# EAGLE design PowerBoard (EAGLE 9.0.0)
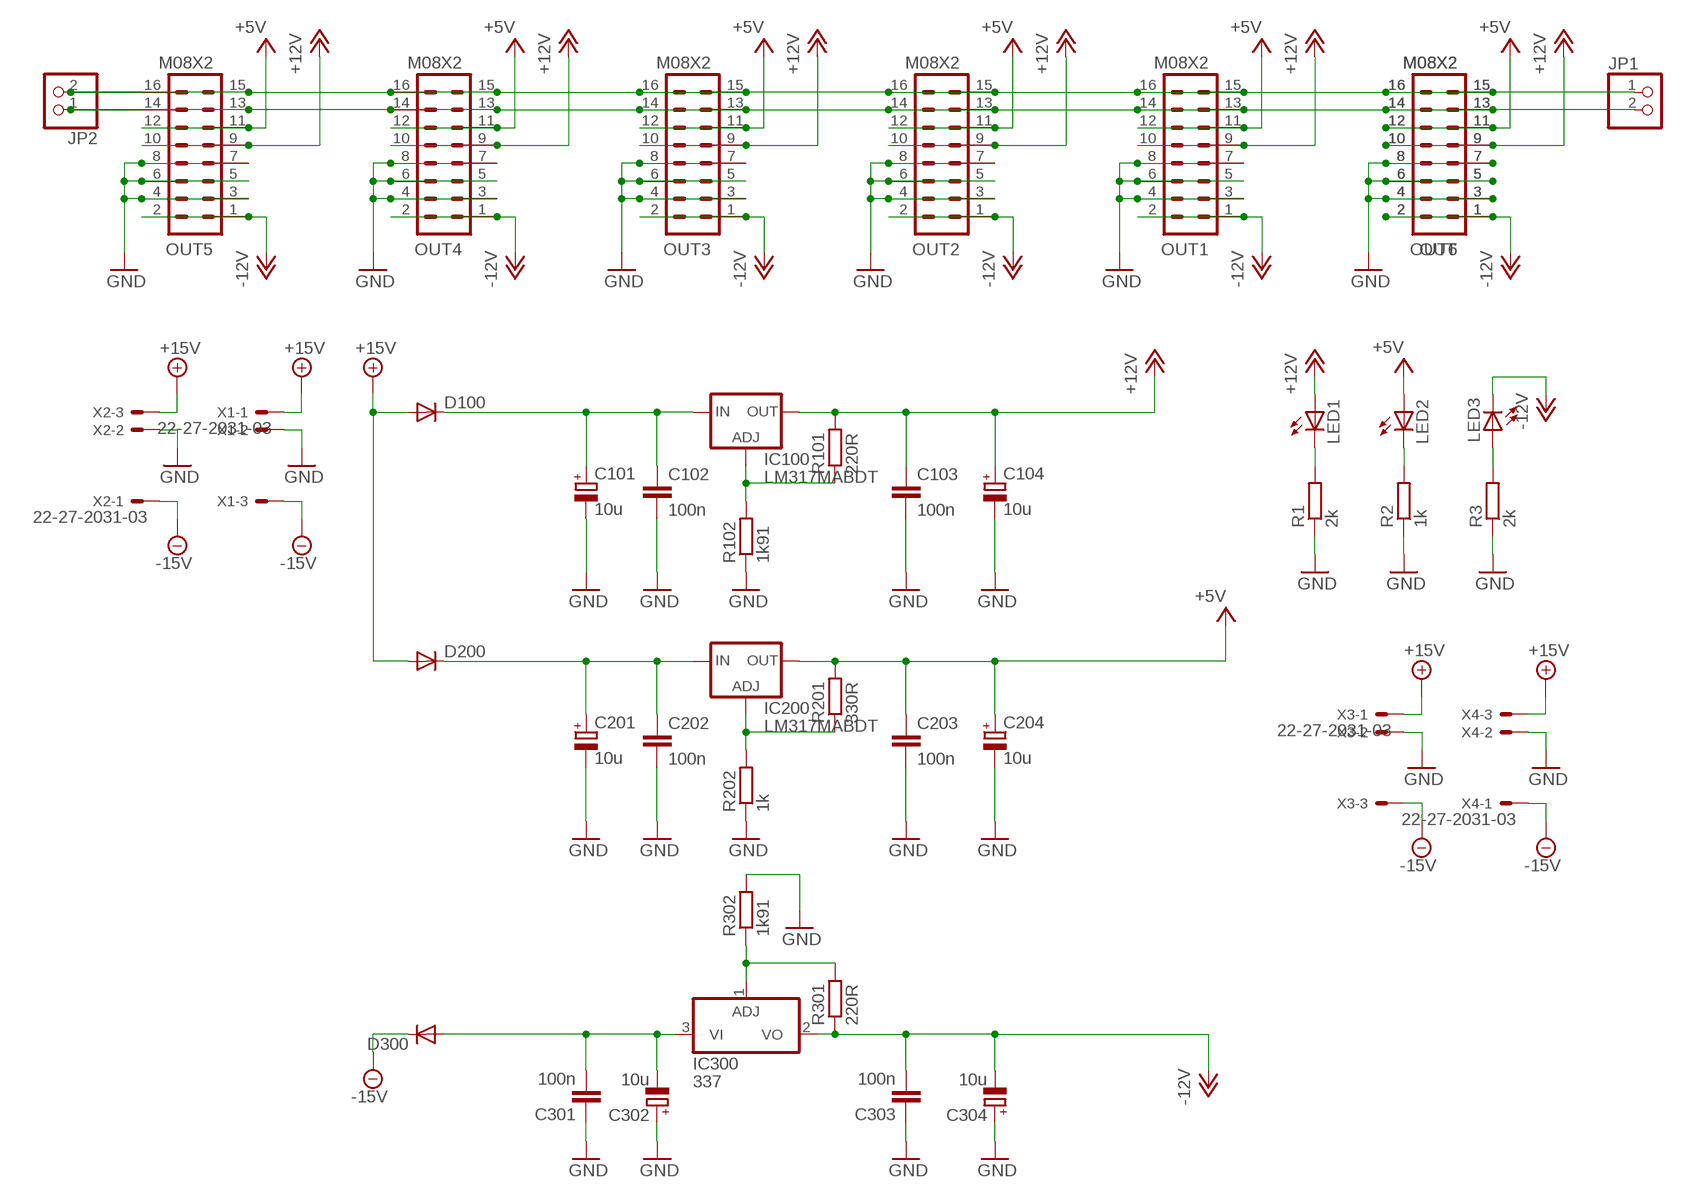
[diagram p0: schematic, sheet 1]

## Parts
C101  10u  CPOL-EU153CLV-0810  [153CLV-0810]
C102  100n  C-EUC0603  [C0603]
C103  100n  C-EUC0603  [C0603]
C104  10u  CPOL-EU153CLV-0810  [153CLV-0810]
C201  10u  CPOL-EU153CLV-0810  [153CLV-0810]
C202  100n  C-EUC0603  [C0603]
C203  100n  C-EUC0603  [C0603]
C204  10u  CPOL-EU153CLV-0810  [153CLV-0810]
C301  100n  C-EUC0603  [C0603]
C302  10u  CPOL-EU153CLV-0810  [153CLV-0810]
C303  100n  C-EUC0603  [C0603]
C304  10u  CPOL-EU153CLV-0810  [153CLV-0810]
D100  DIODESMA  [SMA-DIODE]
D200  DIODESMA  [SMA-DIODE]
D300  DIODESMA  [SMA-DIODE]
IC100  LM317MABDT  [DPACK]
IC200  LM317MABDT  [DPACK]
IC300  337  [TO252]
JP1  PINHD-1X2  [1X02]
JP2  PINHD-1X2  [1X02]
LED1  LEDCHIPLED_1206  [CHIPLED_1206]
LED2  LEDCHIPLED_1206  [CHIPLED_1206]
LED3  LEDCHIPLED_1206  [CHIPLED_1206]
OUT  M08X2  [2X8]
OUT1  M08X2  [2X8]
OUT2  M08X2  [2X8]
OUT3  M08X2  [2X8]
OUT4  M08X2  [2X8]
OUT5  M08X2  [2X8]
OUT6  M08X2  [2X8]
R1  2k  R-EU_0603  [0603]
R2  1k  R-EU_0603  [0603]
R3  2k  R-EU_0603  [0603]
R101  220R  R-EU_0603  [0603]
R102  1k91  R-EU_0603  [0603]
R201  330R  R-EU_0603  [0603]
R202  1k  R-EU_0603  [0603]
R301  220R  R-EU_0603  [0603]
R302  1k91  R-EU_0603  [0603]
X1  22-27-2031-03  [6410-03]
X2  22-27-2031-03  [6410-03]
X3  22-27-2031-03  [6410-03]
X4  22-27-2031-03  [6410-03]

## Nets
+5V: C203.1 C204.+ IC200.4(OUT) LED2.A OUT1.11 OUT1.12 OUT2.11 OUT2.12 OUT3.11 OUT3.12 OUT4.11 OUT4.12 OUT5.11 OUT5.12 OUT6.11 OUT6.12 OUT.11 OUT.12 R201.2
+12V: C103.1 C104.+ IC100.4(OUT) LED1.A OUT1.9 OUT1.10 OUT2.9 OUT2.10 OUT3.9 OUT3.10 OUT4.9 OUT4.10 OUT5.9 OUT5.10 OUT6.9 OUT6.10 OUT.9 OUT.10 R101.2
+15V: D100.A D200.A X1.1 X2.3 X3.1 X4.3
-12V: C303.2 C304.- IC300.2(VO) LED3.C OUT1.1 OUT1.2 OUT2.1 OUT2.2 OUT3.1 OUT3.2 OUT4.1 OUT4.2 OUT5.1 OUT5.2 OUT6.1 OUT6.2 OUT.1 OUT.2 R301.1
-15V: D300.C X1.3 X2.1 X3.3 X4.1
GND: C101.- C102.2 C103.2 C104.- C201.- C202.2 C203.2 C204.- C301.1 C302.+ C303.1 C304.+ OUT1.3 OUT1.4 OUT1.5 OUT1.6 OUT1.7 OUT1.8 OUT2.3 OUT2.4 OUT2.5 OUT2.6 OUT2.7 OUT2.8 OUT3.3 OUT3.4 OUT3.5 OUT3.6 OUT3.7 OUT3.8 OUT4.3 OUT4.4 OUT4.5 OUT4.6 OUT4.7 OUT4.8 OUT5.3 OUT5.4 OUT5.5 OUT5.6 OUT5.7 OUT5.8 OUT6.3 OUT6.4 OUT6.5 OUT6.6 OUT6.7 OUT6.8 OUT.3 OUT.4 OUT.5 OUT.6 OUT.7 OUT.8 R1.1 R2.1 R3.1 R102.1 R202.1 R302.2 X1.2 X2.2 X3.2 X4.2
N$1: LED1.C R1.2
N$2: LED2.C R2.2
N$3: IC100.1(ADJ) R101.1 R102.2
N$4: IC200.1(ADJ) R201.1 R202.2
N$5: IC300.1(ADJ) R301.2 R302.1
N$6: C301.2 C302.- D300.A IC300.3(VI)
N$7: C201.+ C202.1 D200.C IC200.3(IN)
N$8: C101.+ C102.1 D100.C IC100.3(IN)
N$9: LED3.A R3.2
N$10: JP1.2 JP2.1 OUT1.13 OUT1.14 OUT2.13 OUT2.14 OUT3.13 OUT3.14 OUT4.13 OUT4.14 OUT5.13 OUT5.14 OUT6.13 OUT6.14 OUT.13 OUT.14
N$12: JP1.1 JP2.2 OUT1.15 OUT1.16 OUT2.15 OUT2.16 OUT3.15 OUT3.16 OUT4.15 OUT4.16 OUT5.15 OUT5.16 OUT6.15 OUT6.16 OUT.15 OUT.16

## Library data of the parts
C101 C104 C201 C204 C302 C304 = rcl:CPOL-EU: POLARIZED CAPACITOR, European symbol
C102 C103 C202 C203 C301 C303 = rcl:C-EU: CAPACITOR, European symbol
D100 D200 D300 = SparkFun:DIODE: Diode These are standard reverse protection diodes and small signal diodes. SMA package can handle up to about 1A. SOD-323 can handle about 200mA. What the SOD-323 package when ordering, there are some mfgs out there that are 5-pin packages.
IC100 IC200 = v-reg:LM317?*: 500 mA Adjustable Output Positive Voltage Regulator Source: http://www.onsemi.co.jp .. LM317M-D.PDF
IC300 = linear:*337: Negative VOLTAGE REGULATOR
JP1 JP2 = pinhead:PINHD-1X2: PIN HEADER
LED1-LED3 = led:LED: LED OSRAM: - CHIPLED LG R971, LG N971, LY N971, LG Q971, LY Q971, LO R971, LY R971 LH N974, LH R974 LS Q976, LO Q976, LY Q976 LO Q996 - Hyper CHIPLED LW Q18S LB Q993, LB Q99A, LB R99A - SideLED LS A670, LO A670, LY A670, LG A670, LP A670 LB A673, LV A673, LT A673, LW A673 LH A674 LY A675 LS A676, LA A676, LO A676, LY A676, LW A676 LS A679, LY A679, LG A679 - Hyper Micro SIDELED® LS Y876, LA Y876, LO Y876, LY Y876 LT Y87S - SmartLED LW L88C, LW L88S LB L89C, LB L89S, LG L890 LS L89K, LO L89K, LY L89K LS L896, LA L896, LO L896, LY L896 - TOPLED LS T670, LO T670, LY T670, LG T670, LP T670 LSG T670, LSP T670, LSY T670, LOP T670, LYG T670 LG T671, LOG T671, LSG T671 LB T673, LV T673, LT T673, LW T673 LH T674 LS T676, LA T676, LO T676, LY T676, LB T676, LH T676, LSB T676, LW T676 LB T67C, LV T67C, LT T67C, LS T67K, LO T67K, LY T67K, LW E67C LS E67B, LA E67B, LO E67B, LY E67B, LB E67C, LV E67C, LT E67C LW T67C LS T679, LY T679, LG T679 LS T770, LO T770, LY T770, LG T770, LP T770 LB T773, LV T773, LT T773, LW T773 LH T774 LS E675, LA E675, LY E675, LS T675 LS T776, LA T776, LO T776, LY T776, LB T776 LHGB T686 LT T68C, LB T68C - Hyper Mini TOPLED® LB M676 - Mini TOPLED Santana® LG M470 LS M47K, LO M47K, LY M47K Source: http://www.osram.convergy.de LUXEON: - LUMILED® LXK2-PW12-R00, LXK2-PW12-S00, LXK2-PW14-U00, LXK2-PW14-V00 LXK2-PM12-R00, LXK2-PM12-S00, LXK2-PM14-U00 LXK2-PE12-Q00, LXK2-PE12-R00, LXK2-PE12-S00, LXK2-PE14-T00, LXK2-PE14-U00 LXK2-PB12-K00, LXK2-PB12-L00, LXK2-PB12-M00, LXK2-PB14-N00, LXK2-PB14-P00, LXK2-PB14-Q00 LXK2-PR12-L00, LXK2-PR12-M00, LXK2-PR14-Q00, LXK2-PR14-R00 LXK2-PD12-Q00, LXK2-PD12-R00, LXK2-PD12-S00 LXK2-PH12-R00, LXK2-PH12-S00 LXK2-PL12-P00, LXK2-PL12-Q00, LXK2-PL12-R00 Source: www.luxeon.com KINGBRIGHT: KA-3528ASYC Source: www.kingbright.com
OUT OUT1-OUT6 = SparkFun:M08X2
R1-R3 R101 R102 R201 R202 R301 R302 = Rebel:R-EU_: RESISTOR, European symbol
X1-X4 = con-molex:22-?-03: CONNECTOR wire to board 2.54 mm (.1 inch) pitch header; MF: MOLEX; OC_FARNELL: unknown; OC_NEWARK: unknown

## Board
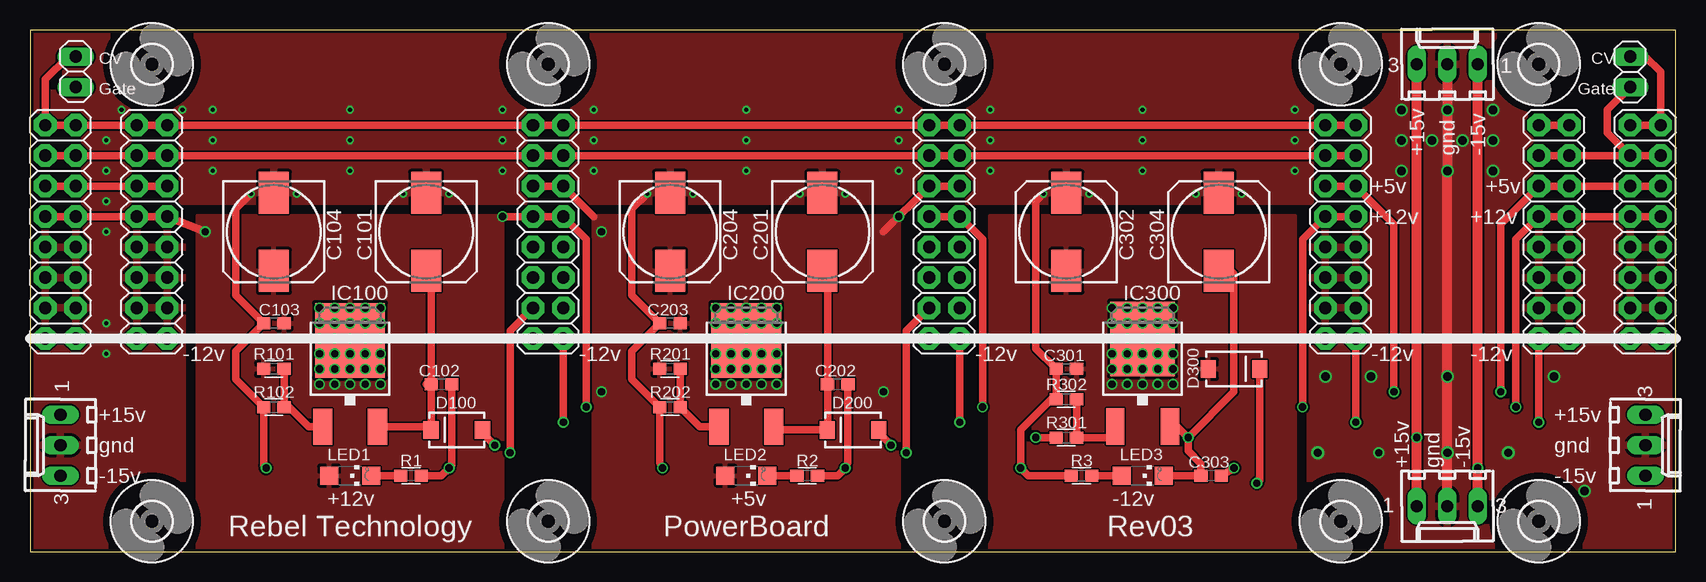
[diagram p1: board, top side]
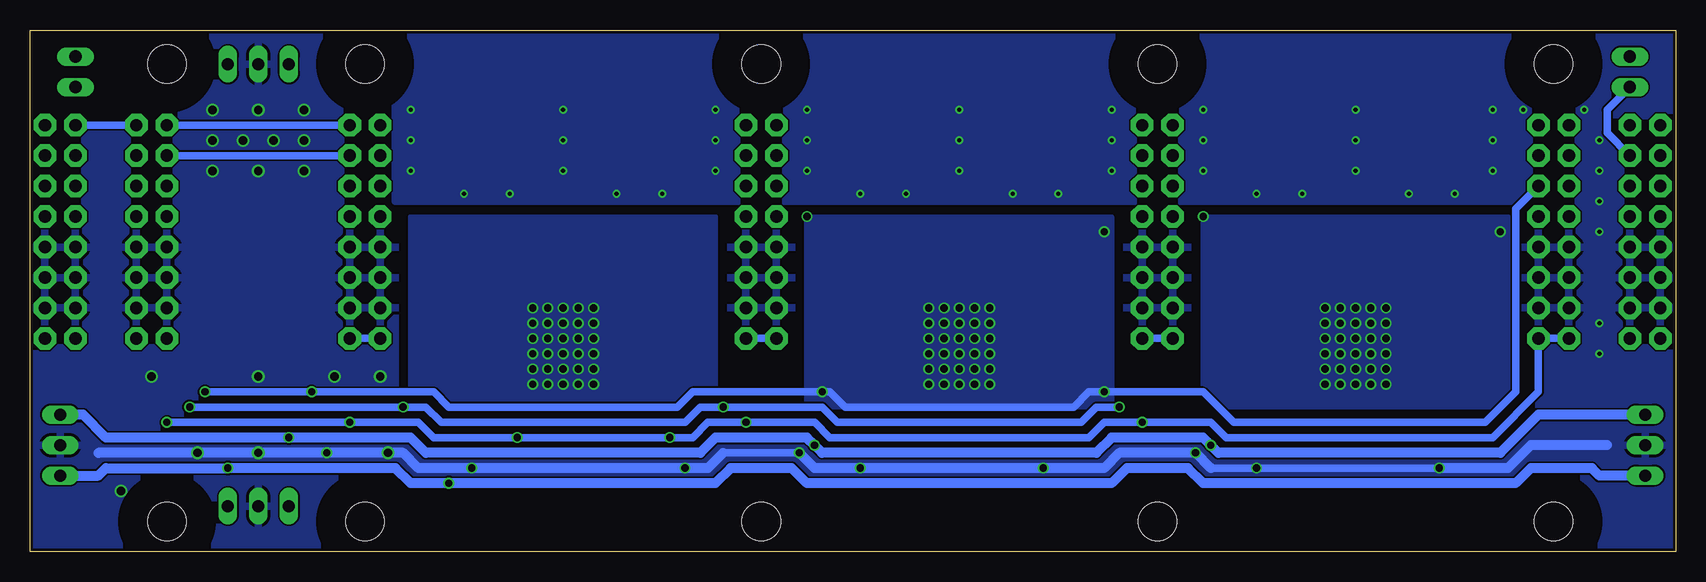
[diagram p2: board, bottom side, seen from below]

Size 137.13 x 43.48 mm. Coordinates in mm from the lower left corner, seen from the top.
Outline: 0,0 137.13,0 137.13,43.48 0,43.48 0,0
Copper layers (1*16): Top 0.035mm / dielectric 1.5mm / Bottom 0.035mm
Design rules "Fusion_eagle_rule_v1.1": minimum track width 6mil, minimum drill 12mil, track to track 6mil, track to pad 6mil, pad to pad 6mil, via to via 6mil, smd to smd 0mil, copper to edge 10mil, drill to drill 10mil, minimum pad ring 10mil, minimum via ring 6mil, stop-mask expansion 2mil, vias tented up to drill 100mil, thermal gap 10mil

### Footprints (pad centres in the part's own frame; a part is rotated, then mirrored left to right if it is on the bottom)
153CLV-0810 = smd 3.5 x 2.5: + 3.25,0; - -3.25,0
C0603 = smd 1.1 x 1: 1 -0.85,0; 2 0.85,0
SMA-DIODE = smd 1.27 x 1.47: A -2.15,0; C 2.15,0
DPACK = smd 1.6 x 3: 1 -2.28,-4.8; 3 2.28,-4.8 | smd 5.8 x 6.2: 4 0,2.38
TO252 = smd 1.524 x 3.048: 1 -2.28,-4.8; 2 2.28,-4.8 | smd 5.4 x 6.2: 3 0,2.5
1X02 = drill 1.016 long: 1 -1.27,0; 2 1.27,0
CHIPLED_1206 = smd 1.5 x 1.5: A 0,-1.75; C 0,1.75
2X8 = drill 1.016 pad 1.88 octagon: 1 0,0; 2 0,2.54; 3 2.54,0; 4 2.54,2.54; 5 5.08,0; 6 5.08,2.54; 7 7.62,0; 8 7.62,2.54; 9 10.16,0; 10 10.16,2.54; 11 12.7,0; 12 12.7,2.54; 13 15.24,0; 14 15.24,2.54; 15 17.78,0; 16 17.78,2.54
0603 = smd 1.1 x 1: 1 -0.85,0; 2 0.85,0
3,2 = hole 3.2: 0,0
6410-03 = drill 1.016 long: 1 2.54,0; 2 0,0; 3 -2.54,0

### Placement (x,y rotation side)
C101  33.02,26.67 270 top
C102  34.29,13.97 0 top
C103  20.32,19.05 180 top
C104  20.32,26.67 270 top
C201  66.04,26.67 270 top
C202  67.31,13.97 0 top
C203  53.34,19.05 180 top
C204  53.34,26.67 270 top
C301  86.36,15.24 0 top
C302  86.36,26.67 90 top
C303  98.42,6.35 180 top
C304  99.06,26.67 90 top
D100  35.56,10.16 180 top
D200  68.58,10.16 180 top
D300  100.33,15.24 0 top
IC100  26.67,15.24 0 top
IC200  59.69,15.24 0 top
IC300  92.71,15.24 0 top
JP1  3.81,40.01 270 top
JP2  133.35,40.01 90 top
LED1  26.67,6.35 270 top
LED2  59.69,6.35 270 top
LED3  92.71,6.35 270 top
OUT  11.43,17.78 90 top
OUT1  44.45,17.78 90 top
OUT2  77.47,17.78 90 top
OUT3  110.49,17.78 90 top
OUT4  135.89,17.78 90 top
OUT5  3.81,17.78 90 top
OUT6  128.27,17.78 90 top
R1  31.75,6.35 180 top
R2  64.77,6.35 180 top
R3  87.63,6.35 0 top
R101  20.32,15.24 180 top
R102  20.32,12.06 0 top
R201  53.34,15.24 180 top
R202  53.34,12.06 0 top
R301  86.36,9.53 0 top
R302  86.36,12.7 180 top
U$1  [3,2]  43.18,2.54 0 top
U$2  [3,2]  109.22,2.54 0 top
U$3  [3,2]  43.18,40.64 0 top
U$4  [3,2]  109.22,40.64 0 top
U$5  [3,2]  10.16,40.64 0 top
U$6  [3,2]  10.16,2.54 0 top
U$7  [3,2]  76.2,40.64 0 top
U$8  [3,2]  76.2,2.54 0 top
U$12  [3,2]  125.73,40.64 0 top
U$13  [3,2]  125.73,2.54 0 top
X1  2.54,8.89 90 top
X2  134.62,8.89 270 top
X3  118.11,3.81 180 top
X4  118.11,40.64 0 top

### Tracks (layer width: path | path; a pad name or v marks a point on that pad's centre or on a via)
+5V  (via drill 0.6)
  Top 0.61: 46.99,27.94 OUT1.11 OUT1.12 | 71.12,26.67 OUT2.12 OUT2.11 | OUT5.12 OUT5.11 OUT.12 OUT.11 | OUT3.12 OUT3.11 113.67,27.3 v113.67,13.34 | v122.56,13.34 122.56,27.3 OUT6.12 OUT6.11 OUT4.12 OUT4.11
  Bottom 0.61: OUT.11 13.34,28.57 13.34,13.34 15.88,10.79 36.83,10.79 39.37,13.34 v47.62,13.34 48.89,13.34 50.16,12.06 69.22,12.06 70.48,13.34 81.92,13.34 83.19,12.06 102.23,12.06 103.51,13.34 v113.67,13.34 v122.56,13.34
  other vias: 57.15,20.32 58.42,20.32 57.15,19.05 58.42,19.05 57.15,17.78 58.42,17.78 59.69,20.32 59.69,19.05 59.69,17.78 60.96,20.32 62.23,20.32 60.96,19.05 62.23,19.05 60.96,17.78 62.23,17.78 62.23,16.51 60.96,16.51 60.96,15.24 62.23,15.24 59.69,16.51 59.69,15.24 58.42,16.51 57.15,16.51 57.15,15.24 57.15,13.97 58.42,15.24 58.42,13.97 59.69,13.97 60.96,13.97 62.23,13.97 47.62,26.67 72.39,27.94 71.12,13.34
  pour Bottom: 46.99,27.94 46.99,12.06 72.39,12.06 72.39,27.94
  pour Top: 46.99,27.94 46.99,0 72.39,0 72.39,27.94
+12V  (via drill 0.6)
  Top 0.61: v46.35,12.06 46.35,26.04 OUT1.9 OUT1.10 v39.37,27.94 | v79.38,12.06 79.38,26.04 OUT2.9 OUT2.10 | v106.05,12.06 106.05,26.04 OUT3.10 OUT3.9 | v14.61,26.67 OUT.9 OUT.10 OUT5.9 OUT5.10 | v123.83,12.06 123.83,26.04 OUT6.10 OUT6.9 OUT4.10 OUT4.9
  Bottom 0.61: v46.35,12.06 48.26,12.06 49.53,10.79 69.85,10.79 71.12,12.06 v79.38,12.06 81.28,12.06 82.55,10.79 102.87,10.79 104.14,12.06 v106.05,12.06 v123.83,12.06
  other vias: 24.13,20.32 25.4,20.32 24.13,19.05 26.67,20.32 27.94,20.32 29.21,20.32 29.21,19.05 27.94,19.05 26.67,19.05 25.4,19.05 24.13,17.78 24.13,16.51 24.13,15.24 24.13,13.97 25.4,17.78 26.67,17.78 27.94,17.78 29.21,17.78 29.21,16.51 27.94,16.51 26.67,16.51 25.4,16.51 25.4,15.24 25.4,13.97 26.67,13.97 26.67,15.24 27.94,15.24 27.94,13.97 29.21,15.24 29.21,13.97
  pour Bottom: 13.97,27.94 13.97,12.06 39.37,12.06 39.37,27.94
  pour Top: 13.97,27.94 13.97,0 39.37,0 39.37,27.94
+15V  (via drill 0.6)
  Top 0.61: D100.A 37.46,10.16 v38.73,8.89 | D200.A 70.48,10.16 v71.76,8.89
  Top 0.813: X3.1 v115.57,9.53 X4.3
  Bottom 0.813: X1.1 11.43,11.43 14.61,8.26 38.1,8.26 v38.73,8.89 39.37,9.53 46.99,9.53 48.26,8.26 71.12,8.26 v71.76,8.89 72.39,9.53 80.01,9.53 81.28,8.26 104.14,8.26 105.41,9.53 v115.57,9.53 130.81,9.53 132.72,11.43 X2.3
-12V  (via drill 0.6)
  Top 0.61: OUT1.1 v44.45,10.79 | OUT2.1 v77.47,10.79 | OUT3.1 v110.49,10.79 | OUT.2 OUT5.1 OUT5.2 | R301.1 v83.82,9.53 | IC300.2 95.61,10.44 v96.52,9.53 | OUT4.1 OUT4.2 OUT6.1 OUT6.2 v125.73,10.79 | C304.- 98.93,24.56 100.33,23.16 100.33,13.34 v96.52,9.53 | v96.52,9.53 96.52,8.41 97.58,7.36 C303.2 LED3.C
  Bottom 0.61: v125.73,10.79 v110.49,10.79 104.78,10.79 103.51,9.53 v96.52,9.53 v83.82,9.53 81.92,9.53 80.65,10.79 v77.47,10.79 71.76,10.79 70.48,9.53 48.89,9.53 47.62,10.79 v44.45,10.79 38.73,10.79 37.46,9.53 15.24,9.53 11.43,13.34 OUT.1 OUT.2 | OUT2.1 OUT2.2 | OUT1.1 OUT1.2 | OUT3.1 OUT3.2
-15V  (via drill 0.6)
  Top 0.61: D300.C 102.48,5.96 v102.23,5.71
  Top 0.813: X3.3 v120.65,6.99 X4.1
  Bottom 0.813: X1.3 6.35,6.35 6.99,6.99 12.07,6.99 13.34,5.71 39.37,5.71 40.64,6.99 45.72,6.99 46.99,5.71 72.39,5.71 73.66,6.99 78.74,6.99 80.01,5.71 v102.23,5.71 105.41,5.71 106.68,6.99 v120.65,6.99 130.81,6.99 131.44,6.35 X2.1
GND  (via drill 0.35, 0.6, 0.7)
  Top 0.61: OUT2.4 73.03,18.41 v73.03,8.26 | 20.32,29.21 C104.- | v19.68,6.99 19.47,7.2 R102.1 17.14,14.39 17.14,16.73 C103.2 17.14,21.38 17.14,28.57 v18.41,29.84 | OUT1.4 40,18.41 v40,8.26 | v52.7,6.99 52.49,7.41 R202.1 50.16,14.39 50.16,16.73 C203.2 50.16,21.38 50.16,28.57 v51.43,29.84 | C202.2 68.16,7.41 v67.95,6.99 67.31,6.35 R2.1 | C204.- 52.78,29.92 | C102.2 35.14,7.2 v34.92,6.99 34.29,6.35 R1.1 | C304.+ 99.06,29.84 | R3.1 83.19,6.35 v82.55,6.99 82.55,10.16 85.09,12.7 R302.2 C301.1 83.82,16.93 83.82,29.21 v84.45,29.84 | C303.1 v100.33,6.99
  Top 0.813: X3.2 v118.11,31.75 X4.2
  Bottom 0.61: v19.68,6.99 v34.92,6.99 38.73,6.99 | v73.03,8.26 79.38,8.26
  Bottom 0.813: 5.71,8.89 12.07,8.89 13.97,6.99 v19.68,6.99 | 38.73,6.99 v40,8.26 46.35,8.26 47.62,6.99 v52.7,6.99 v67.95,6.99 71.76,6.99 v73.03,8.26 | 79.38,8.26 80.65,6.99 v82.55,6.99 v100.33,6.99 104.78,6.99 106.05,8.26 v112.4,8.26 v118.11,8.26 131.44,8.26
  other vias: 118.11,14.61 15.24,36.83 26.67,36.83 39.37,36.83 46.99,36.83 59.69,36.83 72.39,36.83 80.01,36.83 92.71,36.83 105.41,36.83 22.23,29.84 31.11,29.84 34.92,29.84 64.14,29.84 67.95,29.84 55.24,29.84 88.27,29.84 97.16,29.84 100.97,29.84 6.35,16.51 6.35,19.05 6.35,26.67 6.35,29.21 6.35,31.75 6.35,34.29 7.62,36.83 12.7,36.83 15.24,34.29 26.67,34.29 39.37,34.29 46.99,34.29 59.69,34.29 72.39,34.29 80.01,34.29 92.71,34.29 105.41,34.29 118.11,36.83 116.84,34.29 119.38,34.29 121.92,34.29 114.3,34.29 114.3,36.83 121.92,36.83 121.92,31.75 114.3,31.75 111.76,14.61 107.95,14.61 127,14.61 129.54,5.08 15.24,31.75 26.67,31.75 39.37,31.75 46.99,31.75 59.69,31.75 72.39,31.75 92.71,31.75 105.41,31.75 80.01,31.75 123.19,8.26 107.31,8.26
  pour Bottom: -1.27,10.79 -1.27,0 138.43,0 138.43,10.79
  pour Bottom: -1.27,44.45 -1.27,0 12.7,0 12.7,29.21 106.68,29.21 106.68,44.45
  pour Bottom: 106.68,44.45 106.68,0 138.43,0 138.43,44.45
  pour Bottom: 106.68,26.67 111.76,26.67 111.76,19.05 106.68,19.05
  pour Bottom: 73.66,26.67 78.74,26.67 78.74,19.05 73.66,19.05
  pour Bottom: 40.64,26.67 45.72,26.67 45.72,19.05 40.64,19.05
  pour Top: 12.7,44.45 106.68,44.45 106.68,29.21 12.7,29.21
  pour Top: 0,44.45 12.7,44.45 12.7,0 0,0
  pour Top: 106.68,44.45 106.68,0 138.43,0 138.43,44.45
N$1
  Top 0.61: R1.2 LED1.C
N$2
  Top 0.61: R2.2 LED2.C
N$3
  Top 0.61: IC100.1 23.21,10.44 21.17,12.48 R102.2 R101.1
N$4
  Top 0.61: R202.2 54.19,13.12 | 57.15,10.16 57.41,10.42 IC200.1 55.81,10.44 R202.2 | R201.1 R202.2
N$5
  Top 0.61: IC300.1 90.15,9.53 R301.2 R302.1
N$6  (via drill 0.6)
  other vias: 90.17,20.32 91.44,20.32 92.71,20.32 93.98,20.32 95.25,20.32 95.25,19.05 93.98,19.05 92.71,19.05 91.44,19.05 90.17,19.05 90.17,17.78 90.17,16.51 90.17,15.24 90.17,13.97 91.44,17.78 91.44,16.51 91.44,15.24 91.44,13.97 92.71,17.78 92.71,16.51 92.71,15.24 93.98,17.78 95.25,17.78 93.98,16.51 95.25,16.51 95.25,15.24 93.98,15.24 92.71,13.97 93.98,13.97 95.25,13.97
  pour Bottom: 80.01,27.94 80.01,12.06 105.41,12.06 105.41,27.94
  pour Top: 80.01,27.94 80.01,0 105.41,0 105.41,27.94
N$7
  Top 0.61: IC200.3 62.25,10.16 D200.C 66.46,10.19 C202.1 66.46,24.27 C201.+ 66.55,24.18
N$8
  Top 0.61: IC100.3 33.13,10.44 D100.C 33.44,10.19 C102.1 | C102.1 33.02,13.97 | 33.52,24.18 C101.+ 33.44,24.27 C102.1
N$9
  Top 0.61: R3.2 LED3.A
N$10
  Top 0.61: OUT5.14 OUT5.13 OUT.14 OUT.13 OUT1.14 OUT1.13 OUT2.14 OUT2.13 OUT3.14 OUT3.13 | OUT4.13 OUT4.14 | OUT4.14 131.44,34.92 131.44,36.83 JP2.1 | OUT6.14 OUT6.13 OUT4.14
  Bottom 0.61: OUT3.13 OUT6.14 | JP1.2 5.71,36.83 5.71,34.92 OUT5.13
N$12
  Top 0.61: OUT3.15 OUT3.16 OUT2.15 OUT2.16 OUT1.15 OUT1.16 OUT.15 OUT.16 OUT5.15 OUT5.16 1.27,39.37 3.18,41.27 JP1.1 | OUT4.16 OUT4.15 135.89,40.01 134.62,41.27 JP2.2 | OUT6.16 OUT6.15
  Bottom 0.61: OUT3.15 OUT6.16 | OUT6.15 OUT4.16

### Text on the board
tPlace: CV | CV | Gate | Gate | +15v | gnd | -15v | +5v | +5v | +12v | +12v | -12v | -12v | -12v | -12v | -12v | +15v | +15v | gnd | gnd | +15v | gnd | -15v | -15v | -15v | +12v | +5v | -12v | Rebel Technology | PowerBoard | Rev03